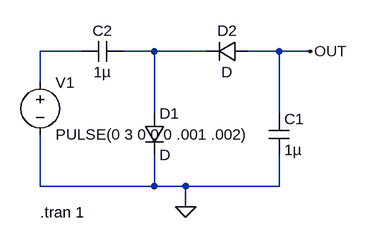
[diagram p0: schematic positiveToNegative.asc]
positiveToNegative.asc, the LTspice schematic file:
Version 4
SHEET 1 880 680
WIRE 128 48 64 48
WIRE 240 48 192 48
WIRE 320 48 240 48
WIRE 432 48 384 48
WIRE 480 48 432 48
WIRE 64 96 64 48
WIRE 240 144 240 48
WIRE 432 144 432 48
WIRE 64 256 64 176
WIRE 240 256 240 208
WIRE 240 256 64 256
WIRE 288 256 240 256
WIRE 432 256 432 208
WIRE 432 256 288 256
WIRE 288 288 288 256
FLAG 288 288 0
FLAG 480 48 OUT
SYMBOL diode 224 144 R0
SYMATTR InstName D1
SYMBOL diode 384 32 R90
WINDOW 0 0 32 VBottom 2
WINDOW 3 32 32 VTop 2
SYMATTR InstName D2
SYMBOL cap 416 144 R0
SYMATTR InstName C1
SYMATTR Value 1µ
SYMBOL voltage 64 80 R0
WINDOW 123 0 0 Left 0
WINDOW 39 0 0 Left 0
SYMATTR InstName V1
SYMATTR Value PULSE(0 3 0 0 0 .001 .002)
SYMBOL cap 192 32 R90
WINDOW 0 0 32 VBottom 2
WINDOW 3 32 32 VTop 2
SYMATTR InstName C2
SYMATTR Value 1µ
TEXT 64 296 Left 2 !.tran 1

The netlist it stands for:
* positiveToNegative.asc
D1 N002 0 D
D2 OUT N002 D
C1 OUT 0 1µ
V1 N001 0 PULSE(0 3 0 0 0 .001 .002)
C2 N002 N001 1µ
.model D D
.lib standard.dio
.tran 1
.backanno
.end